# Altium schematic sheet Sheet1.SchDoc
size A; SheetNumber: 1; SheetTotal: 1
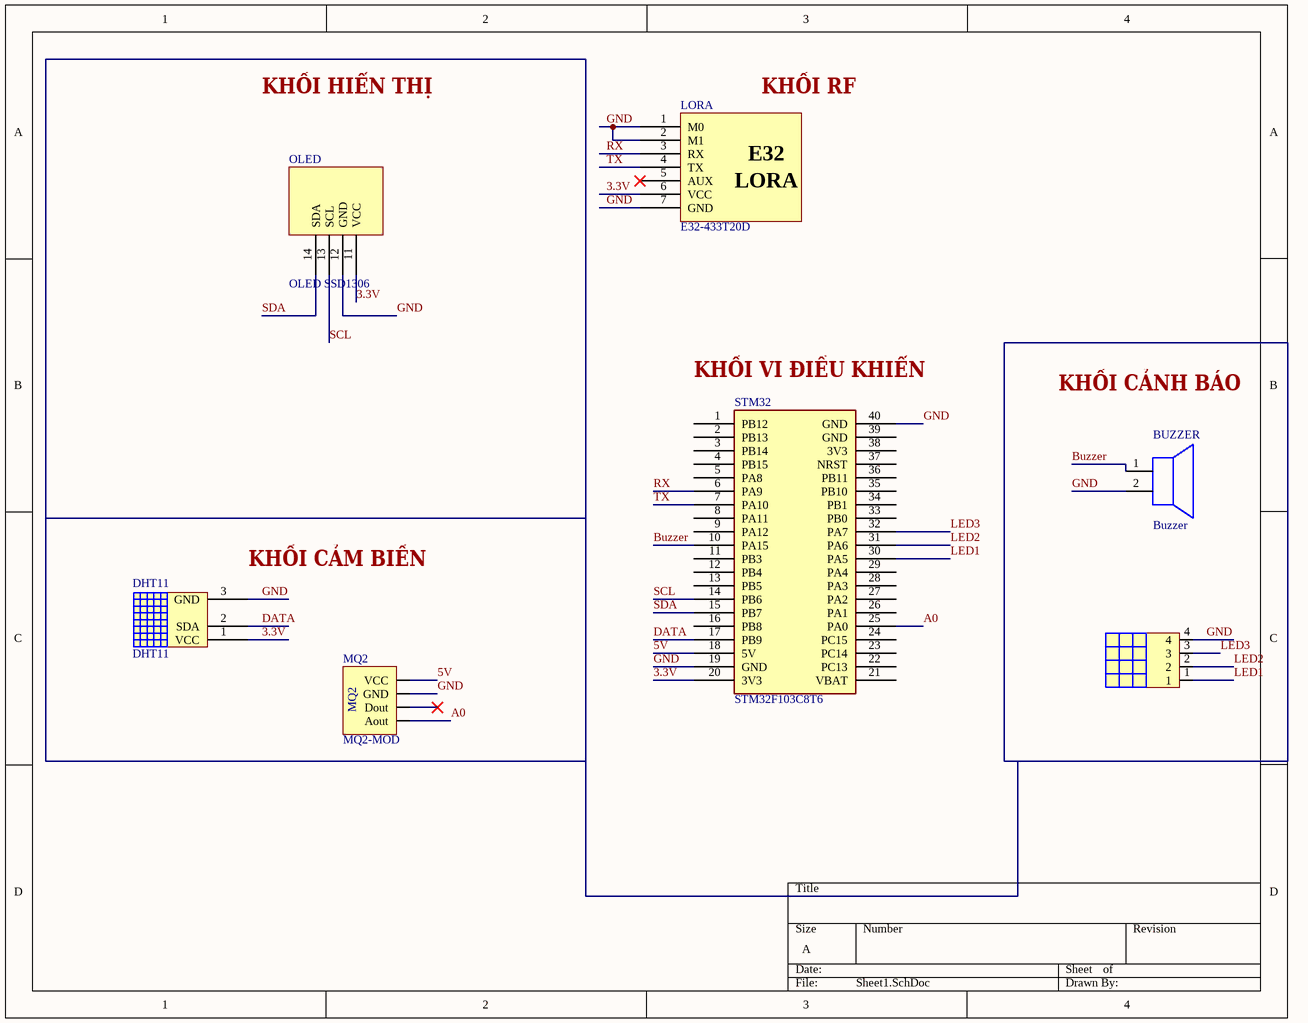
[diagram p0: Sheet1.SchDoc]

## Parts
BUZZER  Buzzer  [speaker]
DHT11  DHT11  [DHT11_KIT]
LED  Dht22  [JST_B4B-XH-A]  (value not drawn)
LORA  E32-433T20D  [LORA_E32]
MQ2  MQ2-MOD  [JST_B4B-XH-A]
OLED  OLED SSD1306  [OLED]
STM32  STM32F103C8T6  [Stm32 BluePill]

## Nets
3.3V: DHT11.1(VCC) LORA.6(VCC) OLED.11(VCC) STM32.20(3V3)
5V: MQ2.4(VCC) STM32.18(5V)
A0: MQ2.1(Aout) STM32.25(PA0)
Buzzer: BUZZER.1(+) STM32.10(PA15)
DATA: DHT11.2(SDA) STM32.17(PB9)
GND: BUZZER.2(-) DHT11.3(GND) LED.4 LORA.1(M0) LORA.2(M1) LORA.7(GND) MQ2.3(GND) OLED.12(GND) STM32.19(GND) STM32.40(GND)
LED1: LED.1 STM32.30(PA5)
LED2: LED.2 STM32.31(PA6)
LED3: LED.3 STM32.32(PA7)
RX: LORA.3(RX) STM32.6(PA9)
SCL: OLED.13(SCL) STM32.14(PB6)
SDA: OLED.14(SDA) STM32.15(PB7)
TX: LORA.4(TX) STM32.7(PA10)

Not connected (* = marked no-connect by the designer): LORA 5(AUX)*; MQ2 2(Dout)*; STM32 1(PB12) 2(PB13) 3(PB14) 4(PB15) 5(PA8) 8(PA11) 9(PA12) 11(PB3) 12(PB4) 13(PB5) 16(PB8) 21(VBAT) 22(PC13) 23(PC14) 24(PC15) 26(PA1) 27(PA2) 28(PA3) 29(PA4) 33(PB0) 34(PB1) 35(PB10) 36(PB11) 37(NRST) 38(3V3) 39(GND)

## Notes on the sheet
- KHỐI HIỂN THỊ
- KHỐI RF
- (near STM32) KHỐI VI ĐIỀU KHIỂN
- KHỐI CẢNH BÁO
- (near DHT11) KHỐI CẢM BIẾN
- (in symbol Lora E32-433T20D) E32

## Library data of the parts
LED = Dht22: Header, 4-Pin; LatestRevisionDate: 17-Jul-2002; LatestRevisionNote: Re-released for DXP Platform.; Publisher: Altium Limited
LORA = Lora E32-433T20D
MQ2 = MQ2-MOD: Manufacturer: W¨¹rth Elektronik eiSos GmbH; partNo: 613004143121; ComponentLink1 Description: Manufacturer; ComponentLink2 Description: Datasheet; NoPins: 04; Created Date: 29 March 2013; ComponentLink1URL: http://www.we-online.com; ComponentLink2URL: http://katalog.we-online.de/em/datasheet/6130xx143121.pdf; Created by: Karrer Zheng
OLED = SSD1306
STM32 = BluePill: Designed By @Alixahedi